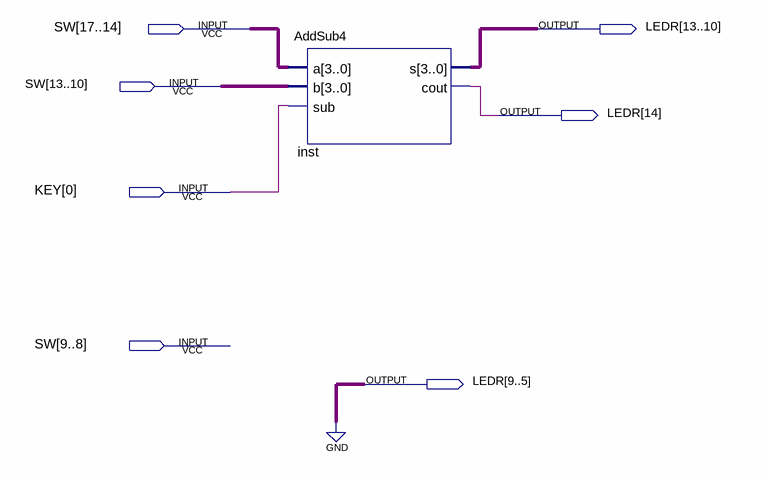
[diagram p0: schematic sheet]
// Quartus schematic AdderDemo.bdf as structural Verilog: 1 symbols, 7 pins
module AdderDemo (
  input  [17:8] SW,
  input  [0:0] KEY,
  output [14:5] LEDR
);

  AddSub4 inst (.a(SW[17:14]), .b(SW[13:10]), .sub(KEY[0]), .s(LEDR[13:10]), .cout(LEDR[14]));

  assign LEDR[9:5] = {5{1'b0}};
endmodule
